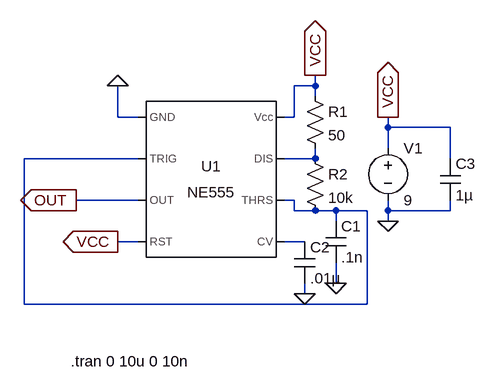
[diagram p0: schematic 555Timer.asc]
555Timer.asc, the LTspice schematic file:
Version 4
SHEET 1 880 680
WIRE 544 -32 544 -48
WIRE 544 -32 512 -32
WIRE 544 -16 544 -32
WIRE 240 16 240 -32
WIRE 272 16 240 16
WIRE 512 16 512 -32
WIRE 512 16 496 16
WIRE 656 32 656 16
WIRE 752 32 656 32
WIRE 656 64 656 32
WIRE 272 80 96 80
WIRE 544 80 544 64
WIRE 544 80 496 80
WIRE 752 80 752 32
WIRE 272 144 176 144
WIRE 512 144 496 144
WIRE 512 160 512 144
WIRE 544 160 512 160
WIRE 576 160 544 160
WIRE 624 160 576 160
WIRE 656 160 656 144
WIRE 752 160 752 144
WIRE 752 160 656 160
WIRE 576 176 576 160
WIRE 656 176 656 160
WIRE 272 208 240 208
WIRE 528 208 496 208
WIRE 576 272 576 240
WIRE 528 288 528 272
WIRE 96 304 96 80
WIRE 624 304 624 160
WIRE 624 304 96 304
FLAG 656 176 0
FLAG 656 16 VCC
IOPIN 656 16 Out
FLAG 176 144 OUT
IOPIN 176 144 Out
FLAG 240 -32 0
FLAG 576 272 0
FLAG 240 208 VCC
IOPIN 240 208 Out
FLAG 544 -48 VCC
IOPIN 544 -48 Out
FLAG 528 288 0
SYMBOL voltage 656 48 R0
WINDOW 123 0 0 Left 0
WINDOW 39 0 0 Left 0
SYMATTR InstName V1
SYMATTR Value 9
SYMBOL res 528 -32 R0
SYMATTR InstName R1
SYMATTR Value 50
SYMBOL res 528 64 R0
SYMATTR InstName R2
SYMATTR Value 10k
SYMBOL cap 560 176 R0
SYMATTR InstName C1
SYMATTR Value .1n
SYMBOL cap 736 80 R0
SYMATTR Value 1µ
SYMATTR InstName C3
SYMATTR SpiceLine V=50 Irms=13m Rser=2.3363 Lser=3.377n mfg="Würth Elektronik" pn="860020672005 WCAP-ATG5 5x11" type="Al electrolytic"
SYMBOL Misc\\NE555 384 112 R0
SYMATTR InstName U1
SYMBOL cap 512 208 R0
SYMATTR InstName C2
SYMATTR Value .01µ
TEXT 168 392 Left 2 !.tran 0 10u 0 10n

The netlist it stands for:
* 555Timer.asc
V1 VCC 0 9
R1 VCC N002 50
R2 N002 N001 10k
C1 N001 0 .1n
C3 VCC 0 1µ V=50 Irms=13m Rser=2.3363 Lser=3.377n mfg="Würth Elektronik" pn="860020672005 WCAP-ATG5 5x11" type="Al electrolytic"
XU1 0 N001 OUT VCC N003 N001 N002 VCC NE555  ; pins GND TRIG OUT RST CV THRS DIS Vcc
C2 N003 0 .01µ
.tran 0 10u 0 10n
.lib NE555.sub
.backanno
.end